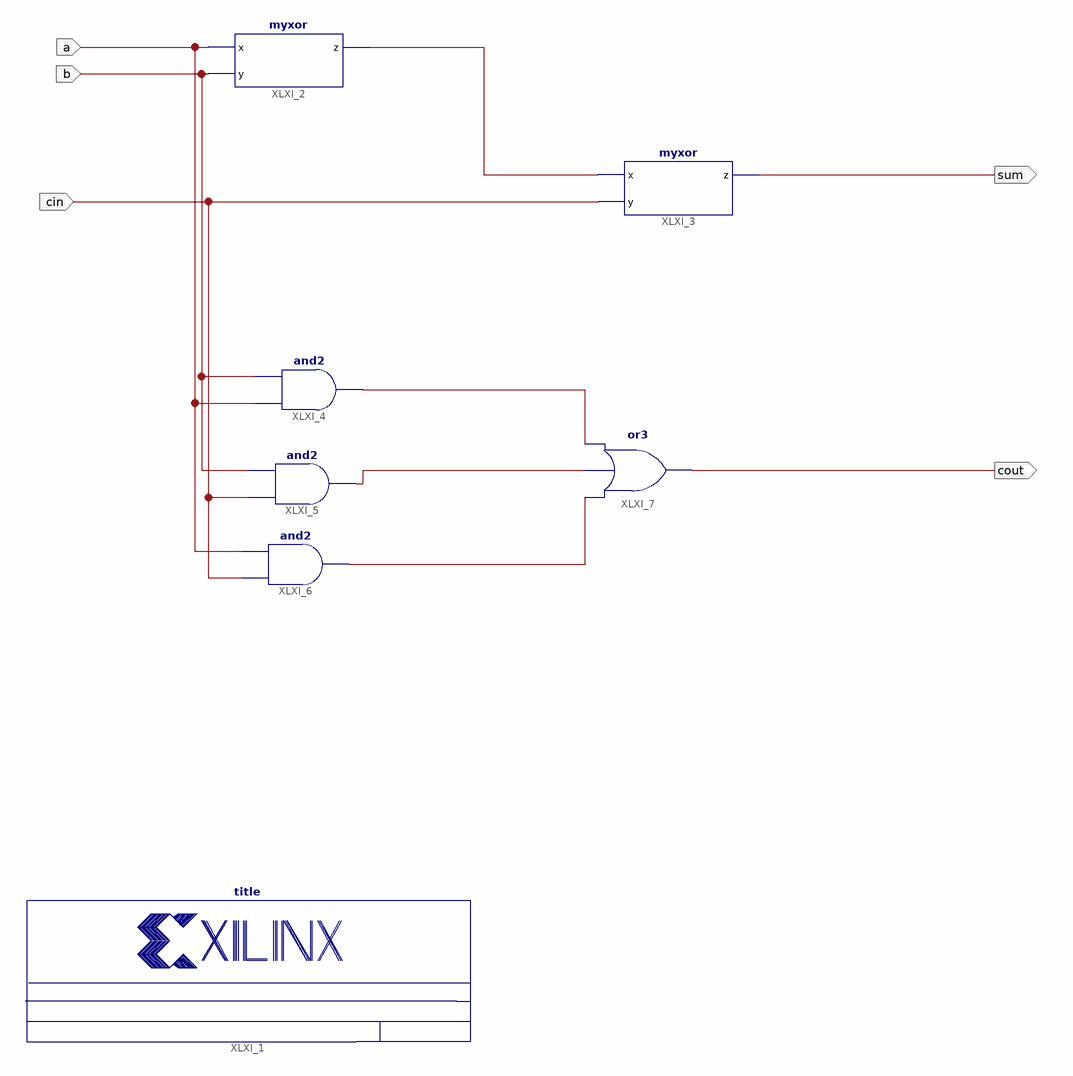
[diagram p0: schematic sheet 1]
// Xilinx ISE schematic full_adder_sch.sch (spartan3e) as structural Verilog: 7 symbols, 5 ports
module full_adder_sch (
  input  b,
  input  a,
  input  cin,
  output sum,
  output cout
);

  wire XLXN_1, XLXN_4, XLXN_5, XLXN_8;

  title #(.NameFieldText("Full adder")) XLXI_1 ();
  myxor XLXI_2 (.x(a), .y(b), .z(XLXN_8));
  myxor XLXI_3 (.x(XLXN_8), .y(cin), .z(sum));
  and XLXI_4 (XLXN_1, a, b);
  and XLXI_5 (XLXN_4, cin, b);
  and XLXI_6 (XLXN_5, cin, a);
  or XLXI_7 (cout, XLXN_5, XLXN_4, XLXN_1);
endmodule
